# Altium schematic sheet joysticks.SchDoc
size A
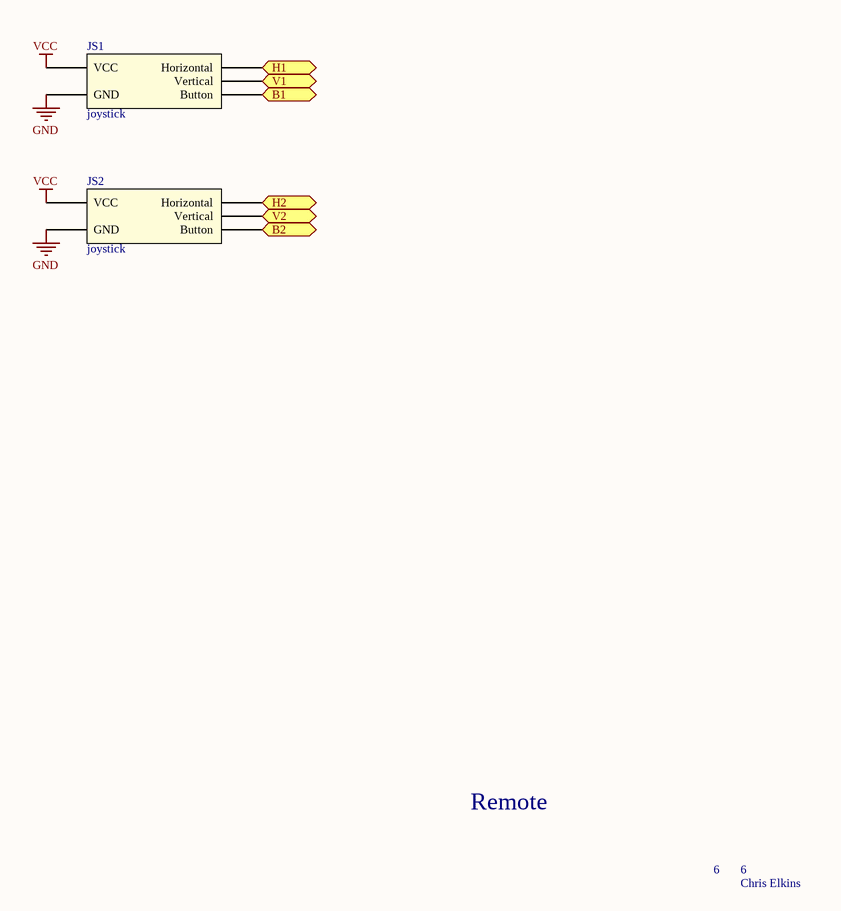
[diagram p0: joysticks.SchDoc]

## Parts
JS1  joystick  [Joystick]
JS2  joystick  [Joystick]

## Ports
B1 (out), B2 (out), H1 (out), H2 (out), V1 (out), V2 (out)

## Nets
GND: JS1.V3(GND) JS2.V3(GND)
VCC: JS1.V1(VCC) JS2.V1(VCC)
B1: JS1.B1A(Button) ; port B1
B2: JS2.B1A(Button) ; port B2
H1: JS1.H2(Horizontal) ; port H1
H2: JS2.H2(Horizontal) ; port H2
V1: JS1.V2(Vertical) ; port V1
V2: JS2.V2(Vertical) ; port V2

## Notes on the sheet
- Remote
- 6
- Chris Elkins